# EAGLE schematic esquemacamiseta1bluetooth (EAGLE 9.4.2)
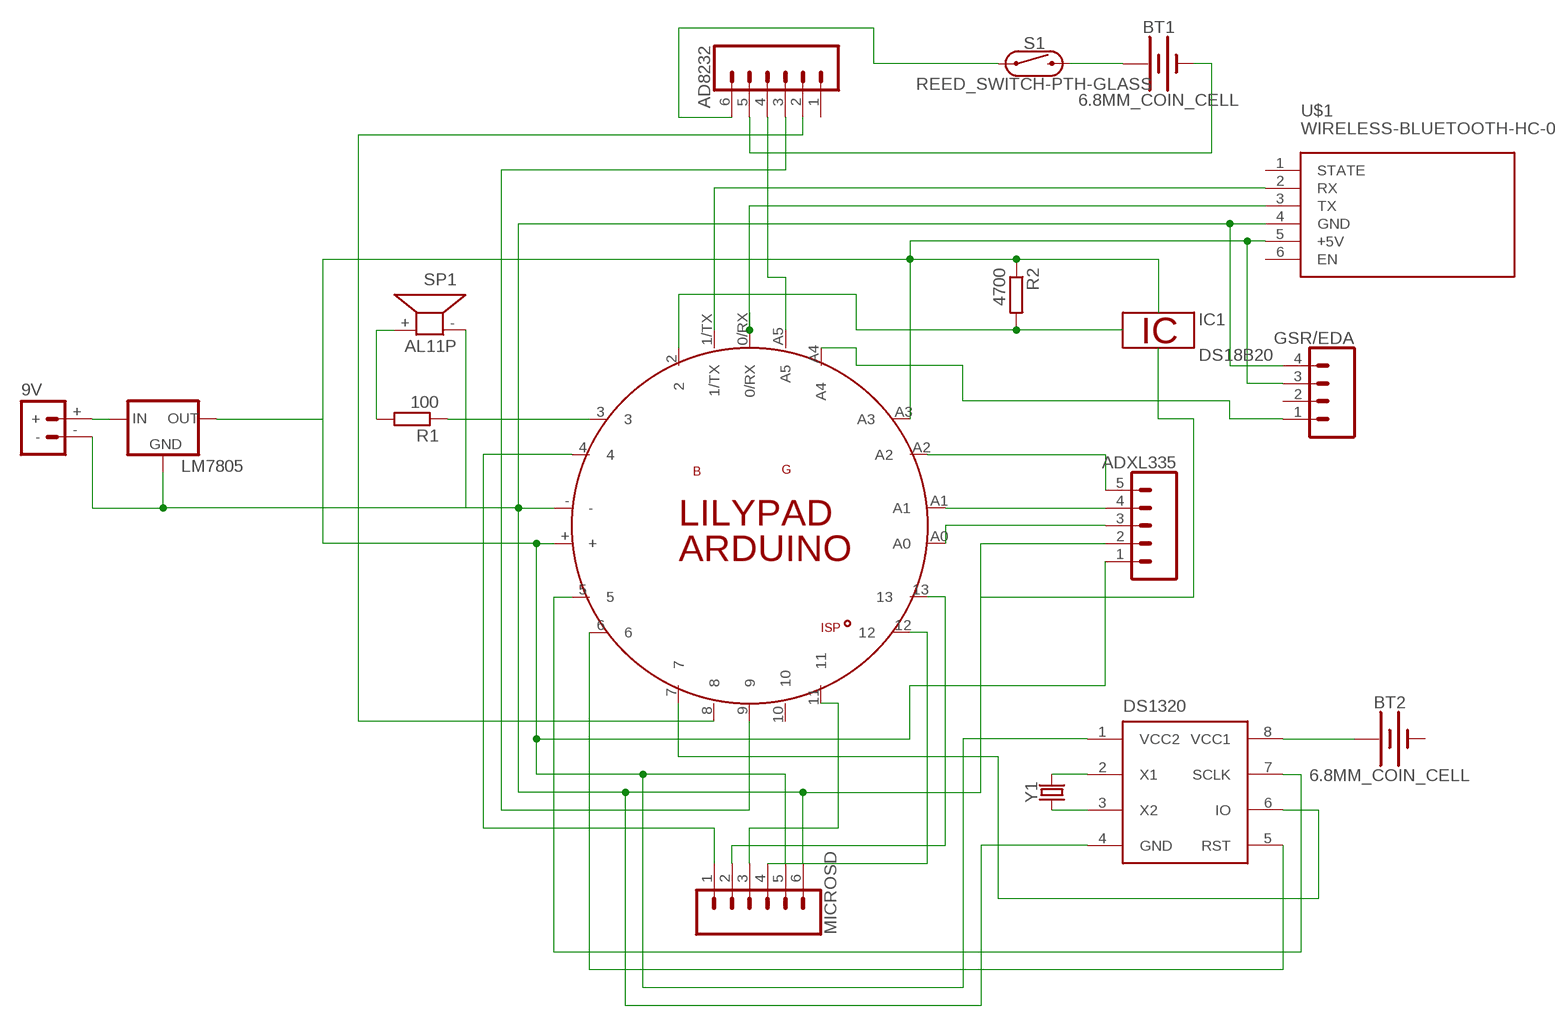
[diagram p0: schematic, sheet 1]

## Parts
9V  BATTERY_CONN_DEANS  [DEANS]
AD8232  CONN_06FEMALE_LOCK  [1X06_FEMALE_LOCK.010]
ADXL335  CONN_05  [1X05]
BT1  6.8MM_COIN_CELL  BATTERY-6.8MM_SMD  [BATTCON-6.8MM]
BT2  6.8MM_COIN_CELL  BATTERY-6.8MM_SMD  [BATTCON-6.8MM]
DS1320  DS1302  [PDIP8]
GSR/EDA  CONN_04JST-PTH  [JST-4-PTH]
IC1  DS18B20  [TO92-]
LM7805  V_REG_78XX-TO-220  [TO-220-ALT]
MICROSD  CONN_06FEMALE_LOCK  [1X06_FEMALE_LOCK.010]
PCB1  ARDUINO_LILYPAD  [ARDUINO_LILYPAD]
R1  100  R-EU_0309/12  [0309/12]
R2  4700  R-EU_0309/12  [0309/12]
S1  REED_SWITCH-PTH-GLASS  [REED_SWITCH_GLASS]
SP1  AL11P  [AL11P]
U$1  WIRELESS-BLUETOOTH-HC-05  [WIRELESS-BLUETOOTH-HC-05]
Y1  CRYSTALPTH-2X6  [CRYSTAL-PTH-2X6-CYL]

## Nets
N$1: MICROSD.1 PCB1.4
N$2: LM7805.OUT
N$3: ADXL335.1 DS1320.1(VCC2) GSR/EDA.3 MICROSD.5 PCB1.+ PCB1.A3 R2.1 U$1.5(+5V)
N$4: R1.2 SP1.+
N$5: PCB1.1/TX U$1.2(RX)
N$6: 9V.- ADXL335.2 DS1320.4(GND) GSR/EDA.4 LM7805.GND MICROSD.6 PCB1.- SP1.- U$1.4(GND)
N$7: MICROSD.3 PCB1.11
N$8: MICROSD.2 PCB1.13
N$9: PCB1.3 R1.1
N$10: DS1320.2(X1) Y1.2
N$11: DS1320.3(X2) Y1.1
N$12: BT2.+ DS1320.8(VCC1)
N$13: DS1320.7(SCLK) PCB1.5
N$14: PCB1.0/RX U$1.3(TX)
N$15: DS1320.5(RST) PCB1.6
N$16: DS1320.6(IO) PCB1.7
N$17: 9V.+ LM7805.IN
N$18: MICROSD.4 PCB1.12
N$19: GSR/EDA.1 PCB1.A4
N$20: ADXL335.5 PCB1.A2
N$21: ADXL335.4 PCB1.A1
N$22: ADXL335.3 PCB1.A0
N$23: PCB1.2 R2.2
N$24: AD8232.2 PCB1.8
N$25: AD8232.4 PCB1.A5
N$26: AD8232.3 PCB1.9
N$27: BT1.+ S1.P$2
N$28: AD8232.6 S1.P$1
N$29: AD8232.5 BT1.-
Unconnected: AD8232.1 GSR/EDA.2 PCB1.5V.(VCC) PCB1.10 PCB1.DTR PCB1.GND. PCB1.GND.. PCB1.GND_(GND) PCB1.MISO PCB1.MOSI PCB1.RESET..(RST) PCB1.RXI PCB1.SCK PCB1.TXO PCB1.VCC. U$1.1(STATE) U$1.6(EN)

## Power pins joined to a net without a drawn wire
1W: IC1.2
-: BT2.-
GND: IC1.1
VDD: IC1.3

## Library data of the parts
9V = SparkFun-Connectors:BATTERY_CONN: Battery Connectors Various footprints for battery connections SparkFun Products: Deans Connector -M/F Pair <https://www.sparkfun.com/products/11864>; SF_ID: PRT-11864
AD8232 MICROSD = SparkFun-Connectors:CONN_06: Multi connection point. Often used as Generic Header-pin footprint for 0.1 inch spaced/style header connections On any of the 0.1 inch spaced packages, you can populate with these: Break Away Headers - Straight <https://www.sparkfun.com/products/116> (PRT-00116) Break Away Male Headers - Right Angle <https://www.sparkfun.com/products/553> (PRT-00553) Female Headers <https://www.sparkfun.com/products/115> (PRT-00115) Break Away Headers - Machine Pin <https://www.sparkfun.com/products/117> (PRT-00117) Break Away Female Headers - Swiss Machine Pin <https://www.sparkfun.com/products/743> (PRT-00743) Arduino Stackable Header - 6 Pin <https://www.sparkfun.com/products/9280> (PRT-09280) For SCREWTERMINALS and SPRING TERMINALS visit here: Screw Terimnals on SparkFun.com <https://www.sparkfun.com/search/results?term=Screw+Terminals> (5mm/3.5mm/2.54mm spacing) This device is also useful as a general connection point to wire up your design to another part of your project. Our various solder wires solder well into these plated through hole pads. Hook-Up Wire - Assortment (Stranded, 22 AWG) <https://www.sparkfun.com/products/11375> (PRT-11375) Hook-Up Wire - Assortment (Solid Core, 22 AWG) <https://www.sparkfun.com/products/11367> (PRT-11367) View the entire wire category on our website here <https://www.sparkfun.com/categories/141>
ADXL335 = SparkFun-Connectors:CONN_05: Multi connection point. Often used as Generic Header-pin footprint for 0.1 inch spaced/style header connections On any of the 0.1 inch spaced packages, you can populate with these: Break Away Headers - Straight <https://www.sparkfun.com/products/116> (PRT-00116) Break Away Male Headers - Right Angle <https://www.sparkfun.com/products/553> (PRT-00553) Female Headers <https://www.sparkfun.com/products/115> (PRT-00115) Break Away Headers - Machine Pin <https://www.sparkfun.com/products/117> (PRT-00117) Break Away Female Headers - Swiss Machine Pin <https://www.sparkfun.com/products/743> (PRT-00743) For SCREWTERMINALS and SPRING TERMINALS visit here: Screw Terimnals on SparkFun.com <https://www.sparkfun.com/search/results?term=Screw+Terminals> (5mm/3.5mm/2.54mm spacing) This device is also useful as a general connection point to wire up your design to another part of your project. Our various solder wires solder well into these plated through hole pads. Hook-Up Wire - Assortment (Stranded, 22 AWG) <https://www.sparkfun.com/products/11375> (PRT-11375) Hook-Up Wire - Assortment (Solid Core, 22 AWG) <https://www.sparkfun.com/products/11367> (PRT-11367) View the entire wire category on our website here <https://www.sparkfun.com/categories/141> Special notes: Molex polarized connector foot print use with SKU : PRT-08231 with associated crimp pins and housings. 1MM SMD Version SKU: PRT-10208
BT1 BT2 = SparkFun-Batteries:BATTERY: Battery - Single Cell A variety of battery chemistries, sizes, and footprints. Device List: 20MM_PTH - Coin Cell Battery Holder - 20mm (PTH) <https://www.sparkfun.com/products/783> 20MM_PTH_KIT- Coin Cell battery Holder - 20 mm (PTH) <http://www.sparkfun.com/products/783>kit version with special mask 6.8MM_PTH - Coin Cell Battery Holder - 6.8MM(SMD) <https://www.digikey.com/product-detail/en/seiko-instruments/MS621FE-FL11E/728-1057-ND/1889208?WT.srch=1&gclid=CNOQ5a6LzdQCFZS2wAodXCkE0g> 12MM_SMD - Coin Cell Battery Holder - 12mm (SMD) <https://www.sparkfun.com/products/10592> 12MM_PTH - Coin Cell Battery Holder - 12mm (PTH) <https://www.sparkfun.com/products/7948> 20MM_SMD - 20mm Coin Cell Battery Holder (SMD) (2 legs) Used on the Big Time Watch Kit <https://www.sparkfun.com/products/11734> 20MM_SMD_4LEGS - Coin Cell Battery Holder - 20mm (SMD) <https://www.sparkfun.com/products/11892> 20MM_SMD_4LEGS_OVERPASTE - Coin Cell Battery Holder - 20mm (SMD) <https://www.sparkfun.com/products/11892> (Over-paste on the legs) 24.5MM_PTH - Coin Cell Battery Holder - 24.5mm (PTH) <https://www.sparkfun.com/products/8863> 9V - 9V Battery Holder - PC Mount Used on the SparkFun SparkPunk Sound Kit <https://www.sparkfun.com/products/11177> and SparkFun SparkPunk Sequencer Kit <https://www.sparkfun.com/products/12707> 18650 - Battery Holder - 18650 (PTH) <https://www.sparkfun.com/products/13113> AA - Battery Holder - 1xAA (PTH) <https://www.sparkfun.com/products/7949> AAA - Battery Holder - 1xAAA (PTH) <https://www.sparkfun.com/products/12718> AA_KIT - Battery Holder - 1xAA (PTH) <https://www.sparkfun.com/products/7949> Special kit package - pads only have exposed copper on one side of the board. AAA_KIT - Battery Holder - 1xAAA (PTH) <https://www.sparkfun.com/products/12718> Special kit package - pads only have exposed copper on one side of the board.; PROD_ID: BATT-13734
DS1320 = ltc1440_lt1529_ds1302:DS1302: DS1302 Realtime Clock The DS1302 trickle-charge timekeeping chip contains a real-time clock/calendar and 31 bytes of static RAM. It communicates with a microprocessor via a simple serial interface. The real-time clock/calendar provides seconds, minutes, hours, day, date, month, and year information. The end of the month date is automatically adjusted for months with fewer than 31 days, including corrections for leap year. The clock operates in either the 24-hour or 12-hour format with an AM/PM indicator. Interfacing the DS1302 with a microprocessor is simplified by using synchronous serial communication. Only three wires are required to communicate with the clock/RAM: CE, I/O (data line), and SCLK (serial clock). Data can be transferred to and from the clock/RAM 1 byte at a time or in a burst of up to 31 bytes. The DS1302 is designed to operate on very low power and retain data and clock information on less than 1µW. The DS1302 is the successor to the DS1202. In addition to the basic timekeeping functions of the DS1202, the DS1302 has the additional features of dual power pins for primary and backup power supplies, programmable trickle charger for VCC1, and seven additional bytes of scratchpad memory.
GSR/EDA = SparkFun-Connectors:CONN_04: Multi connection point. Often used as Generic Header-pin footprint for 0.1 inch spaced/style header connections On any of the 0.1 inch spaced packages, you can populate with these: Break Away Headers - Straight <https://www.sparkfun.com/products/116> (PRT-00116) Break Away Male Headers - Right Angle <https://www.sparkfun.com/products/553> (PRT-00553) Female Headers <https://www.sparkfun.com/products/115> (PRT-00115) Break Away Headers - Machine Pin <https://www.sparkfun.com/products/117> (PRT-00117) Break Away Female Headers - Swiss Machine Pin <https://www.sparkfun.com/products/743> (PRT-00743) For SCREWTERMINALS and SPRING TERMINALS visit here: Screw Terimnals on SparkFun.com <https://www.sparkfun.com/search/results?term=Screw+Terminals> (5mm/3.5mm/2.54mm spacing) This device is also useful as a general connection point to wire up your design to another part of your project. Our various solder wires solder well into these plated through hole pads. Hook-Up Wire - Assortment (Stranded, 22 AWG) <https://www.sparkfun.com/products/11375> (PRT-11375) Hook-Up Wire - Assortment (Solid Core, 22 AWG) <https://www.sparkfun.com/products/11367> (PRT-11367) View the entire wire category on our website here <https://www.sparkfun.com/categories/141> Special notes: Molex polarized connector foot print use with SKU : PRT-08231 with associated crimp pins and housings. 1MM SMD Version SKU: PRT-10208; PROD_ID: WIRE-13531; SF_ID: PRT-09916
IC1 = 1wire:DS18B20: Programmable Resolution Digital Thermometer This chip provides a onewire thermosensor with approx. 0.5°C accuracy. A programmable over/undertemperure alarm is available. The precision can be set from 9..12 bits. Notes: Vdd must be applied for accurate measurements at low temperatures, as the parasite power circuit otherwise heats the sensor. If parasite power is used, Vdd has to be connected to GND. The DS1822 is a low-cost thermometer chip, the DS18S20 is similar to the DS18B20, but with 9 Bit precision only. Author: Jan Kandziora <jjj@gmx.de>
LM7805 = SparkFun-IC-Power:V_REG_78XX: Voltage Regulator Standard 78xx regulator. IGO (Input Ground Output). Spark Fun Electronics SKU : COM-00107; PROD_ID: VREG-08450; SF_ID: COM-00107
PCB1 = E14_Arduino_revB:ARDUINO_LILYPAD: Device for representing a Lilypad Arduino board with a footprint in an EAGLE design. Created by Dave Young for Element14. More EAGLE documentation at: http://www.element14.com/community/community/knode/cadsoft_eagle
R1 R2 = rcl:R-EU_: RESISTOR, European symbol; SPICEPREFIX: R
S1 = SparkFun-Switches:REED_SWITCH: Reed Switch A reed switch is a magnetically-actuated switch. When the device is exposed to a magnetic field, the two ferrous materials inside the switch pull together and the switch closes. Variant Overview PTH-GLASS Reed Switch <https://www.sparkfun.com/products/8642> (COM-08642) - PTH reed switch w/ glass body (6.0 x 0.9 mm) PTH-INSULATED Reed Switch - Insulated <https://www.sparkfun.com/products/10601> (COM-10601) - PTH reed switch w/ insulated body (15.1 x 4.2 mm); PROD_ID: SWCH-09282; SF_SKU: COM-08642
SP1 = buzzer:AL11P: SPEAKER Source: Buerklin; OC_FARNELL: unknown; OC_NEWARK: unknown
U$1 = diy-modules:WIRELESS-BLUETOOTH-HC-05: Bluetooth Transceiver Module based on HC-05 board Tutorial is available here: https://arduino-info.wikispaces.com/BlueTooth-HC05-HC06-Modules-How-To Click here to find device on ebay.com <http://www.ebay.com/sch/hc-05+module+rs232>
Y1 = SparkFun-Clocks:CRYSTAL: Crystals (Generic) These are passive quartz crystals, which can be used as a clock source for a microcontroller. Crystal's are two-terminal devices. They require external "load" capacitors to generate an oscillating signal.